# Altium schematic sheet Microcontroller.SchDoc
size A3; SheetNumber: 2; SheetTotal: 2
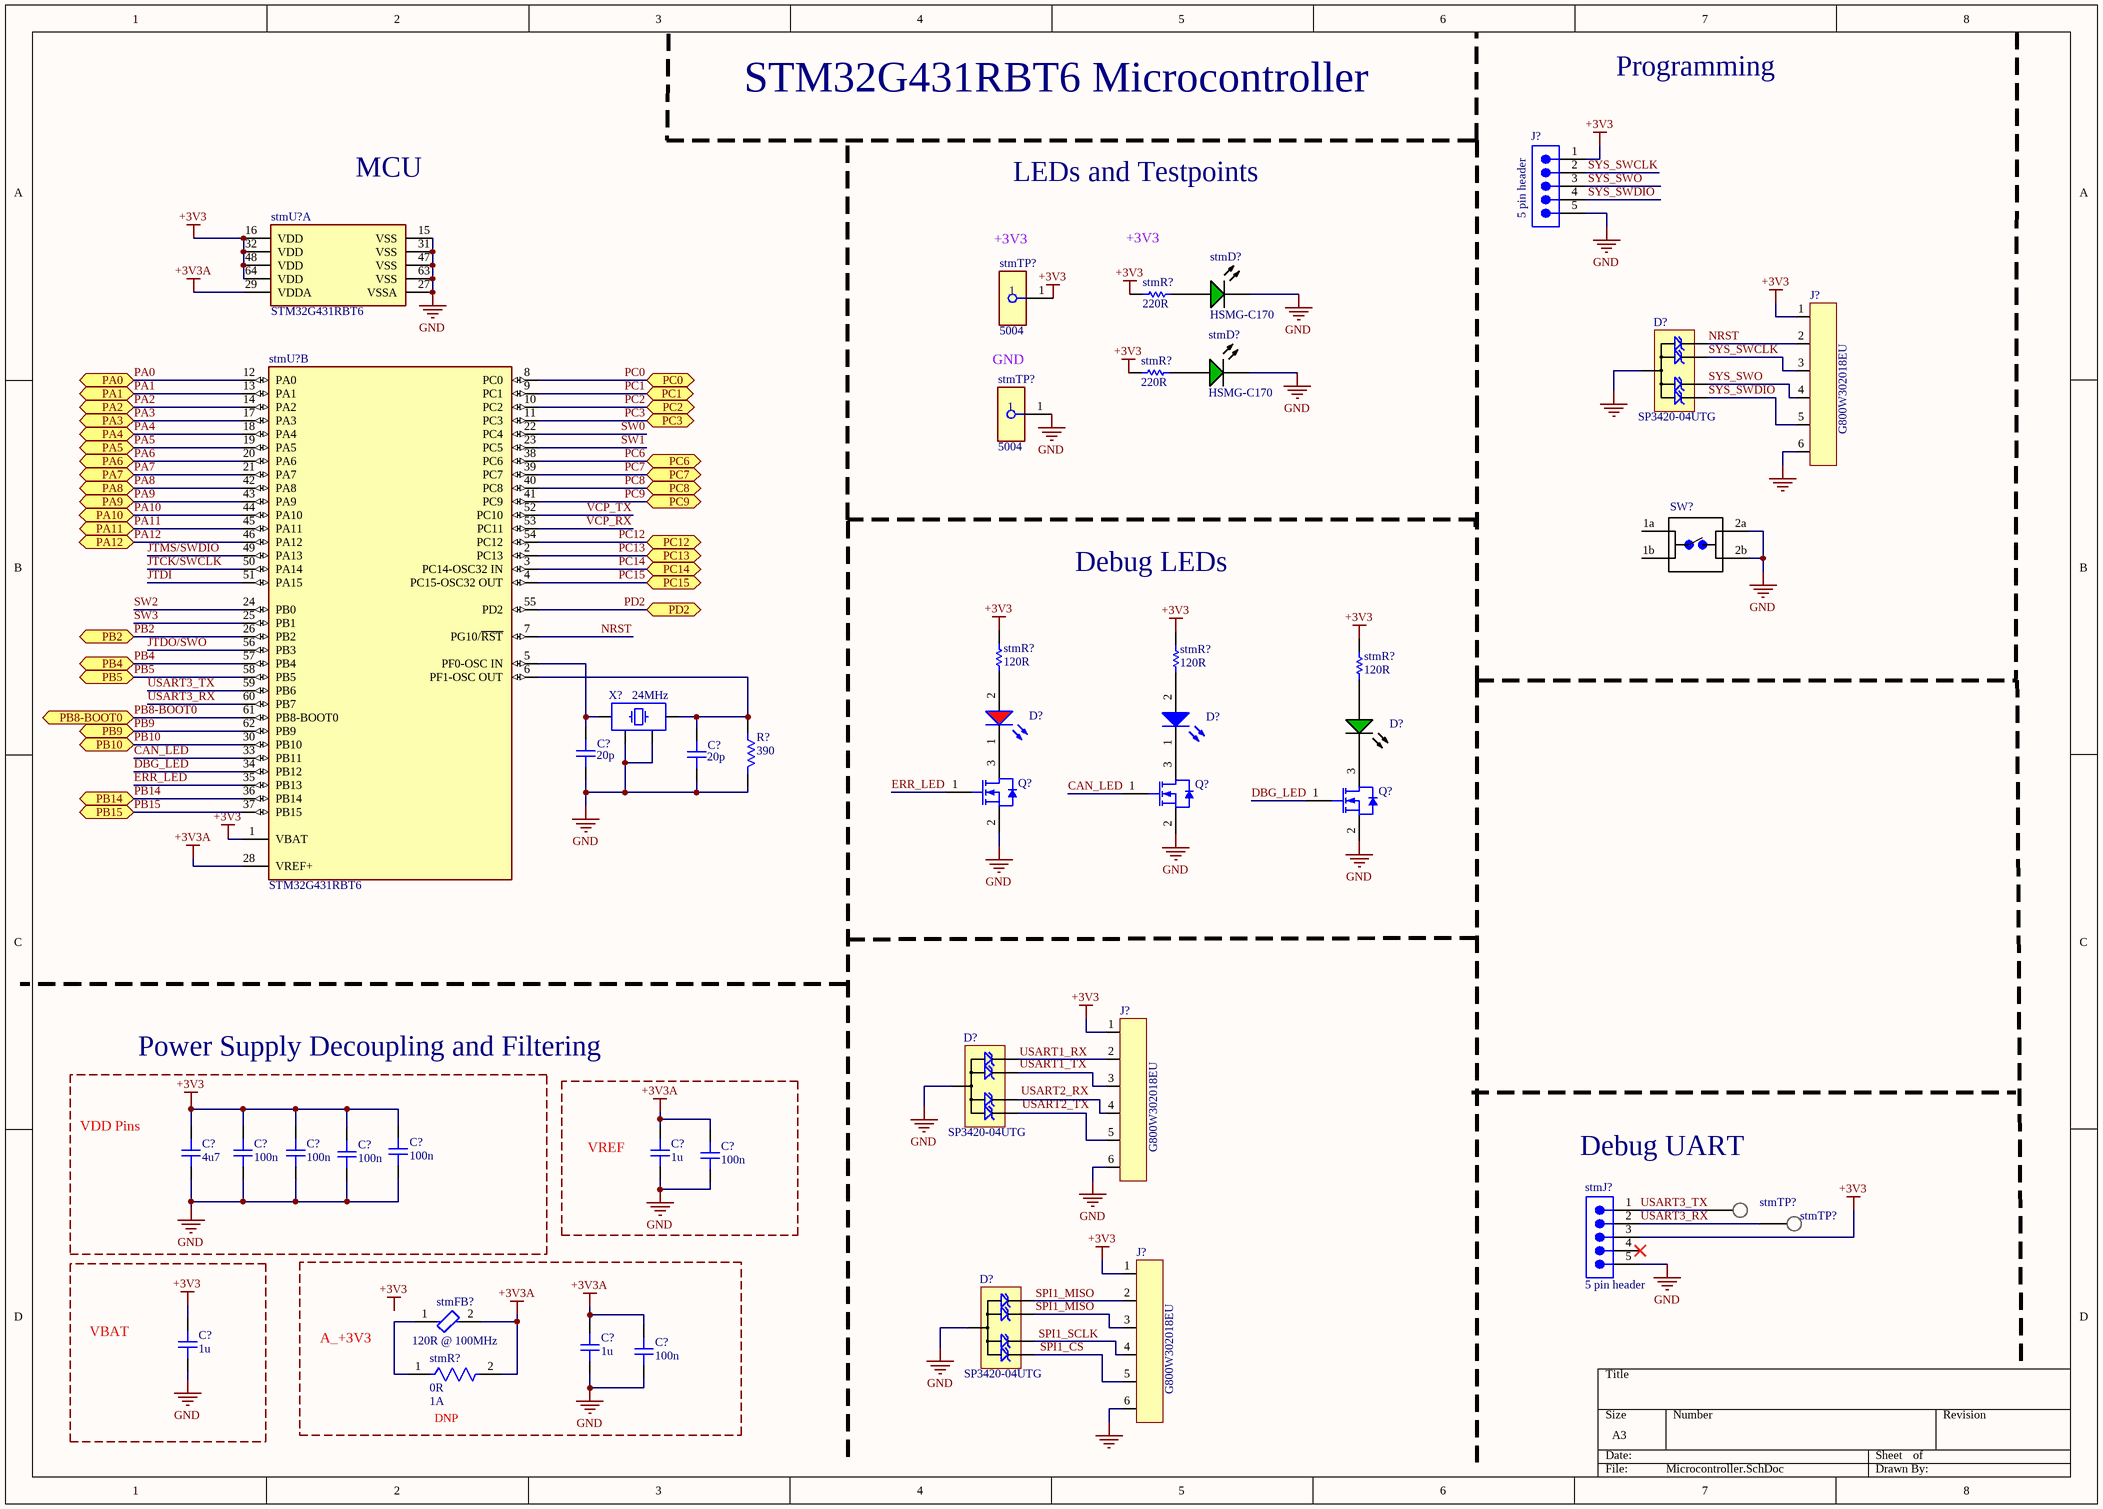
[diagram p0: Microcontroller.SchDoc]

## Parts
(Parts that share a designator on the sheet are numbered #1, #2 ... from top to bottom, then left to right.)
C?#1  20p  [CAP_0603]
C?#2  20p  [CAP_0603]
C?#3  4u7  [CAP_0805]
C?#4  100n  [CAP_0603]
C?#5  100n  [CAP_0603]
C?#6  100n  [CAP_0603]
C?#7  100n  [CAP_0603]
C?#8  1u  [CAP_0603]
C?#9  100n  [CAP_0603]
C?#10  1u  [CAP_0603]
C?#11  1u  [CAP_0603]
C?#12  100n  [CAP_0603]
D?#1  SP3420-04UTG  [uDFN-10]
D?#2  New Red LED  [WL-SMCW_0805_150080xx75000]  (value not drawn)
D?#3  New Blue LED  [WL-SMCW_0805_150080xx75000]  (value not drawn)
D?#4  New Green LED  [LUMX-SML-LXT0805_V]  (value not drawn)
D?#5  SP3420-04UTG  [uDFN-10]
D?#6  SP3420-04UTG  [uDFN-10]
J?#1  5 pin header  [61300511121]
J?#2  G800W302018EU  [G800W302018EU]
J?#3  G800W302018EU  [G800W302018EU]
J?#4  G800W302018EU  [G800W302018EU]
Q?#1  MGSF1N02LT1G  [ONSC-SOT-23-3-318-08_V]  (value not drawn)
Q?#2  MGSF1N02LT1G  [ONSC-SOT-23-3-318-08_V]  (value not drawn)
Q?#3  MGSF1N02LT1G  [ONSC-SOT-23-3-318-08_V]  (value not drawn)
R?  390  [RES_0603]
stmD?#1  HSMG-C170  [AVAG-HSMX-C170_V]
stmD?#2  HSMG-C170  [AVAG-HSMX-C170_V]
stmFB?  120R @ 100MHz  [FP-MMZ1005-IPC_C]
stmJ?  5 pin header  [61300511121]
stmR?#1  220R  [RESC1005X40X25LL05T05]
stmR?#2  220R  [RESC1005X40X25LL05T05]
stmR?#3  120R  [RESC1005X40X25NL05T10]
stmR?#4  120R  [RESC1005X40X25NL05T10]
stmR?#5  120R  [RESC1005X40X25NL05T10]
stmR?#6  Resistance: 0R  Rated Current: 1A  [FP-CRG0402-IPC_C]  (hidden comment: CRG0402ZR)
stmTP?#1  5004  [FP-5004-MFG]
stmTP?#2  5004  [FP-5004-MFG]
stmTP?#3  Test Point  [Test Point pad]  (value not drawn)
stmTP?#4  Test Point  [Test Point pad]  (value not drawn)
stmU?#1  STM32G431RBT6  [FP-LQFP64-5W-MFG]  (part A of 2)
stmU?#2  STM32G431RBT6  [FP-LQFP64-5W-MFG]  (part B of 2)
SW?  Switch 6mm 24V (NO)  [Switch 6mm 24V (NO)]  (value not drawn)
X?  24MHz  [XTAL_3225]

## Blocks framed on the sheet
Power Supply Decoupling and Filtering: C?#3-C?#7
VREF: C?#8 C?#9
VBAT: C?#10
A_+3V3: C?#11 C?#12 stmFB? stmR?#6

## Ports
PA0 (bidir), PA1 (bidir), PA2 (bidir), PA3 (bidir), PA4 (bidir), PA5 (bidir), PA6 (bidir), PA7 (bidir), PA8 (bidir), PA9 (bidir), PA10 (bidir), PA11 (bidir), PA12 (bidir), PB2 (bidir), PB4 (bidir), PB5 (bidir), PB8-BOOT0 (bidir), PB9 (bidir), PB10 (bidir), PB14 (bidir), PB15 (bidir), PC0 (bidir), PC1 (bidir), PC2 (bidir), PC3 (bidir), PC6 (bidir), PC7 (bidir), PC8 (bidir), PC9 (bidir), PC12 (bidir), PC13 (bidir), PC14 (bidir), PC15 (bidir), PD2 (bidir)

## Nets
+3V3: C?#3.2 C?#4.2 C?#5.2 C?#6.2 C?#7.2 C?#10.2 J?#1.1 J?#2.1 J?#3.1 J?#4.1 stmJ?.3 stmR?#1.1 stmR?#2.1 stmR?#3.1 stmR?#4.1 stmR?#5.1 stmTP?#1.1 stmU?#1.16(VDD) stmU?#1.32(VDD) stmU?#1.48(VDD) stmU?#1.64(VDD) stmU?#2.1(VBAT)
+3V3A: C?#8.2 C?#9.2 C?#11.2 C?#12.2 stmFB?.2 stmR?#6.2 stmU?#1.29(VDDA) stmU?#2.28(VREF+)
GND: C?#1.1 C?#2.1 C?#3.1 C?#4.1 C?#5.1 C?#6.1 C?#7.1 C?#8.1 C?#9.1 C?#10.1 C?#11.1 C?#12.1 D?#1.38(GND) D?#5.38(GND) D?#6.38(GND) J?#1.5 J?#2.6 J?#3.6 J?#4.6 Q?#1.2(S) Q?#2.2(S) Q?#3.2(S) R?.1 stmD?#1.2(K) stmD?#2.2(K) stmJ?.5 stmTP?#2.1 stmU?#1.15(VSS) stmU?#1.27(VSSA) stmU?#1.31(VSS) stmU?#1.47(VSS) stmU?#1.63(VSS) SW?.2a SW?.2b X?.2 X?.4
CAN_LED: Q?#2.1(G) stmU?#2.33(PB11)
DBG_LED: Q?#3.1(G) stmU?#2.34(PB12)
ERR_LED: Q?#1.1(G) stmU?#2.35(PB13)
JTCK/SWCLK: stmU?#2.50(PA14)
JTDI: stmU?#2.51(PA15)
JTDO/SWO: stmU?#2.56(PB3)
JTMS/SWDIO: stmU?#2.49(PA13)
NRST: D?#1.110 J?#2.2 stmU?#2.7(PG10/~{RST})
PA0: stmU?#2.12(PA0) ; port PA0
PA1: stmU?#2.13(PA1) ; port PA1
PA2: stmU?#2.14(PA2) ; port PA2
PA3: stmU?#2.17(PA3) ; port PA3
PA4: stmU?#2.18(PA4) ; port PA4
PA5: stmU?#2.19(PA5) ; port PA5
PA6: stmU?#2.20(PA6) ; port PA6
PA7: stmU?#2.21(PA7) ; port PA7
PA8: stmU?#2.42(PA8) ; port PA8
PA9: stmU?#2.43(PA9) ; port PA9
PA10: stmU?#2.44(PA10) ; port PA10
PA11: stmU?#2.45(PA11) ; port PA11
PA12: stmU?#2.46(PA12) ; port PA12
PB2: stmU?#2.26(PB2) ; port PB2
PB4: stmU?#2.57(PB4) ; port PB4
PB5: stmU?#2.58(PB5) ; port PB5
PB8-BOOT0: stmU?#2.61(PB8-BOOT0) ; port PB8-BOOT0
PB9: stmU?#2.62(PB9) ; port PB9
PB10: stmU?#2.30(PB10) ; port PB10
PB14: stmU?#2.36(PB14) ; port PB14
PB15: stmU?#2.37(PB15) ; port PB15
PC0: stmU?#2.8(PC0) ; port PC0
PC1: stmU?#2.9(PC1) ; port PC1
PC2: stmU?#2.10(PC2) ; port PC2
PC3: stmU?#2.11(PC3) ; port PC3
PC6: stmU?#2.38(PC6) ; port PC6
PC7: stmU?#2.39(PC7) ; port PC7
PC8: stmU?#2.40(PC8) ; port PC8
PC9: stmU?#2.41(PC9) ; port PC9
PC12: stmU?#2.54(PC12) ; port PC12
PC13: stmU?#2.2(PC13) ; port PC13
PC14: stmU?#2.3(PC14-OSC32_IN) ; port PC14
PC15: stmU?#2.4(PC15-OSC32_OUT) ; port PC15
PD2: stmU?#2.55(PD2) ; port PD2
SPI1_CS: D?#6.56 J?#4.5
SPI1_MISO: D?#6.29 J?#4.3
SW0: stmU?#2.22(PC4)
SW1: stmU?#2.23(PC5)
SW2: stmU?#2.24(PB0)
SW3: stmU?#2.25(PB1)
SYS_SWCLK: D?#1.29 J?#1.2 J?#2.3
SYS_SWDIO: D?#1.56 J?#1.4 J?#2.5
SYS_SWO: D?#1.47 J?#1.3 J?#2.4
USART3_RX: stmJ?.2 stmTP?#4.1 stmU?#2.60(PB7)
USART3_TX: stmJ?.1 stmTP?#3.1 stmU?#2.59(PB6)
VCP_RX: stmU?#2.53(PC11)
VCP_TX: stmU?#2.52(PC10)
NetC?#1_2: C?#1.2 stmU?#2.5(PF0-OSC_IN) X?.1
NetC?#2_2: C?#2.2 R?.2 stmU?#2.6(PF1-OSC_OUT) X?.3
NetD?#2_1: D?#2.1(K) Q?#1.3(D)
NetD?#2_2: D?#2.2(A) stmR?#3.2
NetD?#3_1: D?#3.1(K) Q?#2.3(D)
NetD?#3_2: D?#3.2(A) stmR?#4.2
NetD?#4_1: D?#4.1(A) stmR?#5.2
NetD?#4_2: D?#4.2(K) Q?#3.3(D)
NetD?#5_29: D?#5.29 J?#3.3
NetD?#5_47: D?#5.47 J?#3.4
NetD?#5_56: D?#5.56 J?#3.5
NetD?#5_110: D?#5.110 J?#3.2
NetD?#6_47: D?#6.47 J?#4.4
NetD?#6_110: D?#6.110 J?#4.2
NetstmD?#1_1: stmD?#1.1(A) stmR?#1.2
NetstmD?#2_1: stmD?#2.1(A) stmR?#2.2
NetstmFB?_1: stmFB?.1 stmR?#6.1

Not connected (* = marked no-connect by the designer): stmJ? 4*; SW? 1a 1b

## Notes on the sheet
- STM32G431RBT6 Microcontroller
- Programming
- (near stmU?#1) MCU
- (near stmTP?#1) +3V3
- LEDs and Testpoints
- +3V3
- (near stmTP?#2) GND
- Debug LEDs
- (near C?#3) VDD Pins
- Debug UART
- Labels drawn without touching a wire or pin: +3V3, SPI1_MISO, SPI1_SCLK, USART1_RX, USART1_TX, USART2_RX, USART2_TX

## Library data of the parts
C?#1 C?#2 = C0603C200J5RACTU: Multilayer Ceramic Capacitors MLCC - SMD/SMT 50V 20pF 5% X7R 0603; Manufacturer: KEMET; Rating: 20p 50V X7R 0603; Manufacturer Part Number: Multilayer Ceramic Capacitors MLCC - SMD/SMT 50V 20pF 5% X7R 0603; Distributor Link: https://www.mouser.tw/datasheet/3/72/1/KEM_C1002_X7R_SMD.pdf; LCSC: N/A; Dielectric: *
C?#3 = CGA4J1X7R1H475K125AC: Multilayer Ceramic Capacitors MLCC - SMD/SMT 0805 50VDC 4.7uF 10% AEC-Q200; Manufacturer: TDK; Rating: 4.7uF 50V X7R 10% 0805; Manufacturer Part Number: CGA4J1X7R1H475K125AC; Distributor Link: https://www.mouser.tw/en/ProductDetail/TDK/CGA4J1X7R1H475K125AC?qs=PqoDHHvF64%252BmskN2S82T2g%3D%3D; Datasheet Link: https://product.tdk.com/system/files/dam/doc/product/capacitor/ceramic/mlcc/catalog/mlcc_automotive_general_en.pdf?ref_disty=mouser; Dielectric: *
C?#4-C?#7 C?#9 C?#12 = MAJCH168BB7104KTEA01: Multilayer Ceramic Capacitors MLCC - SMD/SMT 100V 0.1uF 0603 X7R 10% AECQ2; Manufacturer: TAIYO YUDEN; Rating: 100nF 100V X7R 0603 10%; Manufacturer Part Number: MAJCH168BB7104KTEA01; Distributor Link: https://www.mouser.tw/en/ProductDetail/TAIYO-YUDEN/MAJCH168BB7104KTEA01?qs=ZcfC38r4PovaTBrG0IdezQ%3D%3D; Datasheet Link: https://www.mouser.com/catalog/specsheets/TAIYO_YUDEN_03-08-2024_MAJCH168BB7104KTEA01_SS.pdf?_gl=1*17qbpp1*_gcl_aw*R0NMLjE3ODUyMjg2NDkuQ2p3S0NBandwcUhUQmhBY0Vpd0FqMkFmdXJYOV9OUy1CV0xFSmd6T0FaYy1HZXR1bHVfaUZmaHVzRkI2bHhkODVUMjVSNlJWbnBOUkFob0NEdHNRQXZEX0J3RQ..*_gcl_au*MTM0NzYwMzc0Mi4xNzgyNDQ3MDMwLjE4MDQ0Nzg2ODUuMTc4NTI5MDg4OS4xNzg1MjkxOTE2LjE1NDk0Mzk5MTcuMTc4NTIxODYwOC4xNzg1MjkxOTE2*_ga*MTg5NTU5OTIyLjE3ODI0NDcwMzM.*_ga_15W4STQT4T*czE3ODUyODM3NTgkbzk5JGcxJHQxNzg1MjkxOTI1JGo0MiRsMCRoMA..; Dielectric: *
C?#8 C?#10 C?#11 = C0603X105K9RACAUTO: Multilayer Ceramic Capacitors MLCC - SMD/SMT 6.3 Vo 1 uF 0603 X7R 10 % AECQ200; Manufacturer: KEMET; Rating: 1u 6.3V X7R 0603; Manufacturer Part Number: C0603X105K9RACAUTO; Distributor Link: https://www.mouser.tw/datasheet/3/72/1/C0603X105K9RACAUTO.pdf; LCSC: N/A; Dielectric: *
D?#1 D?#5 D?#6 = SP3420-04UTG: TVS Diode Array Low Capacitance ESD Protection 4-Channel (Vwork=3V3, Vclamp=6V); Manufacturer: Littelfuse; Manufacturer Part Number: SP3420-04UTG
D?#2 = CMP-00039-1: Single Color LED, Red, Water Clear, 1.4mm; Forward Current: 30mA; Luminous Intensity-Nom: 150mcd; Viewing Angle: 140°; Channels: 1; Shape: Rectangular; Overall Height: 0.7mm; Pins: 2; Max Operating Temperature: 85°C; Packaging: Tape and Reel; Size: 1.4mm; Reach SVHC Compliant: Yes; Min Operating Temperature: -40°C; Color: Red; Lens Style: WATER CLEAR; Optoelectronic Device Type: SINGLE COLOR LED; Terminal Pitch: 2.1mm; RoHS Compliant: Yes; Mounting Technology: Surface Mount
D?#3 = CMP-00040-1: Single Color LED, Blue, Water Clear, 1.4mm; Viewing Angle: 140°; Shape: Rectangular; Forward Current: 30mA; Luminous Intensity-Nom: 145mcd; Channels: 1; Overall Height: 0.7mm; Optoelectronic Device Type: SINGLE COLOR LED; Packaging: Tape and Reel; Reach SVHC Compliant: Yes; Min Operating Temperature: -40°C; Lens Style: WATER CLEAR; Color: Blue; Size: 1.4mm; Pins: 2; Mounting Technology: Surface Mount; RoHS Compliant: Yes; Max Operating Temperature: 85°C; Terminal Pitch: 2.1mm
D?#4 = CMP-00037-2: Single Color LED, Green, Water Clear, 1.4mm; Shape: Rectangular; Luminous Intensity-Nom: 450mcd; Forward Current: 30mA; Channels: 1; Viewing Angle: 140°; Overall Height: 0.7mm; Mounting Technology: Surface Mount; Min Operating Temperature: -40°C; Size: 1.4mm; Packaging: Tape and Reel; Reach SVHC Compliant: Yes; Pins: 2; Max Operating Temperature: 85°C; Color: Green; RoHS Compliant: Yes; Optoelectronic Device Type: SINGLE COLOR LED; Lens Style: WATER CLEAR; Terminal Pitch: 2.1mm
J?#1 stmJ? = CMP-065-000003-2: Board Connector, 5 Contact(s), 1 Row(s), Male, Straight, 0.1 inch Pitch, Solder Terminal, Locking, Black Insulator, Plug
J?#2-J?#4 = G800W302018EU: Pin Header 6 Position 2.54mm Pitch; Manufacturer: Amphenol; Manufacturer Part Number: G800W302018EU
Q?#1-Q?#3 = CMP-1058-00777-1: Power MOSFET, 750 mA, 20 V, N-Channel, 3-Pin SOT-23, Pb-Free, Tape and Reel; Manufacturer: On Semiconductor; Crss Typ (pF): 45; Ciss Typ (pF): 125; VGS(th) Max (V): 2.4; Coss Typ (pF): 120; PD Max (W): 0.4; VGS Max (V): 20; Configuration: Single; Channel Polarity: N Channel; ID Max (A): 0.75; PackageReference: SOT-23-3-318-08; ComponentLink2Description: Datasheet; PackageVersion: Rev. AP, 11/2009; ComponentLink1URL: http://www.onsemi.com/; RoHS: Pb-Free; Mounting Technology: Surface Mount; Package Type: SOT-23-3; ComponentLink1Description: Manufacturer URL; V(BR)DSS Min (V): 20; PackageDescription: 3-Pin Small Outline Transistor, Body 2.92 x 1.3 mm, Pitch 0.95 mm; Packing: Tape and Reel; PartNumber: MGSF1N02LT1G; DatasheetVersion: Rev. 6; ComponentLink2URL: http://www.onsemi.cn/pub_link/Collateral/MGSF1N02LT1-D.PDF; ComponentLink3URL: http://www.onsemi.cn/pub_link/Collateral/318-08.PDF; ComponentLink3Description: Package Specification
R? = ERA-3VEB3900V: Thin Film Resistors - SMD 0603 0.1% 390ohm 25ppm SMD; Manufacturer: Panasonic; Ratings: 390ohm 0603 0.1% 1/8W; Manufacturer Part Number: ERA-3VEB3900V; Distributor Link: https://industrial.panasonic.com/cdbs/www-data/pdf/RDM0000/RDM0000C331.pdf; LCSC: N/A
stmD?#1 stmD?#2 = CMP-2000-05062-1: Chip LED, Green, 2.2 V, -40 to 85 degC, 2-Pin SMD, Pb-Free, Tape and Reel; Manufacturer: Avago; No. of Pins: 2; Peak Wavelength: 570nm; SVHC: NoSVHC(16-Jun-2014); Dominant Wavelength: 572nm; Forward Current If: 20mA; Viewing Angle: 170deg; Lens Shape: Rectangular; PIV Max: 5V; External Width: 1.25mm; LED Type: Standard; External Depth: 0.8mm; Opto Mounting Orientation: Top; Luminous Intensity: 15mcd; Luminous Intensity Min: 4mcd; Forward Voltage VF Max: 2.6V; External Length / Height: 2mm; Bulb Size: 1.25mmx1.4mm; Light Area Height: 1mm; Voltage Vf Typ: 2.2V; Operating Temperature Max: 85degC; Datasheet Version: Oct-08; MSL: MSL2A-4weeks; Peak Forward Current: 20mA; Package Description: 2-Pin Surface Mount Device, Body 2 x 1.25 mm, Height 0.8 mm; Datasheet URL: https://datasheet.ciiva.com/29280/180495-da-01-en-chip-led-hsmg-c170-gelb-gruen-29280971.pdf; Storage Temperature Min: -40degC; LED Colour: Green; Wavelength Typ: 570nm; Mounting Type: SMD; Forward Current If Max: 20mA; Dominant Wavelength Typ: 572nm; LED Mounting: SMD; Operating Temperature Range: -30degCto+85degC; Operating Temperature Min: -30degC; Manufacturer URL: http://www.avagotech.com/; Packaging: CutTape; Luminous Intensity Typ: 15mcd; Package Reference: HSMX-C170; Storage Temperature Max: 85degC; Opto Case Style: SMD; Forward Voltage: 2.2V
stmFB? = CMP-08257-000320-1: Signal Line Ferrite Bead 120Ω @ 100MHz 350mA DCR 600mΩ AEC-Q200 SMD 0402 MMZ1005D121CTD25; DC Resistance-Max: 600mR; Number of Lines: 1; Max Current Rating: 350mA; Mount: Surface Mount; Case Code (Imperial): 0402; Case Code (Metric): 1005; Lead Free: Lead Free; Series: MMZ; Min Operating Temperature: -55°C; DC Resistance (DCR): 600mR; Height: 0.022inch; Case/Package: 0402; Current Rating: 350mA; Ratings: AEC-Q200; Packaging: Tape and Reel; Max Operating Temperature: 125°C; RoHS Compliant: Yes; Length: 0.039inch; Impedance: 120R; Width: 0.02inch; Package Quantity: 10000
stmR?#1 stmR?#2 = CMP-2002-01131-1: ERJ2RKF2200X; Manufacturer: Panasonic; Part Number: ERJ2RKF2200X
stmR?#3-stmR?#5 = CMP-2002-07370-1: RC0402FR-07120RL; Manufacturer: Yageo / Phycomp; Part Number: RC0402FR-07120RL
stmR?#6 = CMP-03211-011400-1: RES SMD 0 OHM JUMPER 1/16W 0402; Number of Resistors: 1; Tolerance: 0%; Voltage Rating: 50V; Insulation Resistance: 1GR; Power Rating: 63mW; Temperature Coefficient: 200ppm/°C; Weight: 2.3E-05oz; Number of Terminations: 2; Technology: THICK FILM; Resistor Type: Thick Film; Mount: Surface Mount; Termination: Solder; Number of Pins: 2; RoHS Compliant: Yes; Packaging: Tape and Reel; Depth: 0.5mm; Case Code (Metric): 1005; Min Operating Temperature: -55°C; Series: CRG; Height: 0.35mm; Voltage Rating (DC): 50V; Case Code (Imperial): 0402; Max Operating Temperature: 125°C; ELV: Compliant; Case/Package: 0402; Length: 1mm; Radiation Hardening: No; Width: 0.5mm; Package Quantity: 10000; DNP: DNP
stmTP?#1 stmTP?#2 = CMP-2000-05575-2: PC TEST POINT MINIATURE YELLOW; Manufacturer: Keystone; Number Of Contacts: 1; Is Female: yes; Device Class L1: Connectors; Manufacturer Part Number: 5004; Digikey Description: PC TEST POINT MINIATURE YELLOW; ComponentLink2URL: https://www.keyelco.com/product-pdf.cfm?p=1313; Lead Free: Yes; ComponentLink2Description: Datasheet; Category: Conn; Height: 4.72mm; Octopart: https://octopart.com/5004-keystone-28591; Mouser Description: TEST POINT PC MINI .040"D YELLOW; Device Class L3: unset; Contact Material: Silver; Package: 5004; Automotive: No; Device Class L2: unset; RoHS: TRUE
stmTP?#3 stmTP?#4 = CMP-012-0000-3: MS27478 - Connectors Receptacle Electrical Solder Mounting Solder Type Hermetic Seal 38999 Series II; Design Item ID: Test Point; Pin Count: 1
stmU?#1 stmU?#2 = CMP-12105-000150-1: IC MCU 32BIT 128KB FLASH 64LQFP; RoHS Compliant: Yes
SW? = CMP-007-0002-3: Switch Tactile OFF (ON) SPST Round Button PC Pins 0.05A 24VDC 100000Cycles 2.55N Thru-Hole Loose; Actuator Material: PBT; Contact Resistance: 100mR; Max Current Rating: 50mA; Actuator Color: Red; Switch Travel: 0.25mm; Illumination Type: Non-Illuminated,Illuminated; Actuator Type: Standard; Switch Function: Off-Mom; Actuator Length: 0.055inch; Max Voltage Rating (DC): 24V; Max Operating Temperature: 85°C; Depth: 7.8mm; Length: 5.99mm; Package Quantity: 750; Min Operating Temperature: -35°C; Mechanical Life: 100000Cycles; Mount: Through Hole; Voltage Rating (DC): 24V; Operating Force: 2.55N; Contact Plating: Silver; Electrical Life: 100000Cycles; Contact Current Rating: 50mA; Series: FSMJ; REACH SVHC: Unknown; Type: Switch; Lead Free: Lead Free; Contact Material: Copper Alloy; RoHS Compliant: Yes; Orientation: Straight; ELV: Compliant; Throw Configuration: SPST; Termination: PC Pins; Packaging: Loose Piece; Radiation Hardening: No
X? = TSX-3225_24.0000MF15X-AC: Crystal SMD 24MHz 10PPM 7pF 3225; Manufacturer: Epson; Manufacturer Part Number: TSX-3225 24.0000MF15X-AC